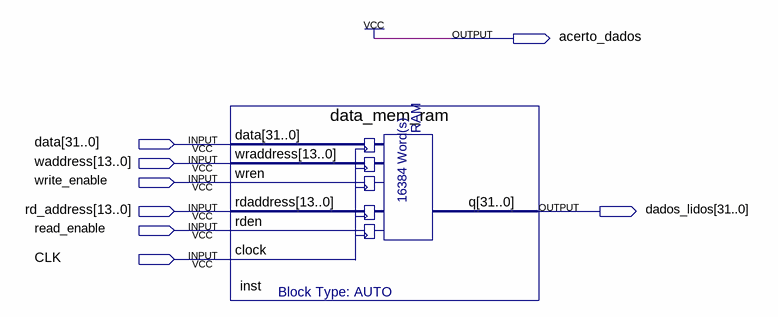
[diagram p0: schematic sheet]
// Quartus schematic datamemory.bdf as structural Verilog: 1 symbols, 8 pins
module datamemory (
  input  [31:0] data,
  input  [13:0] waddress,
  input  write_enable,
  input  [13:0] rd_address,
  input  read_enable,
  input  CLK,
  output acerto_dados,
  output [31:0] dados_lidos
);

  data_mem_ram inst (
    .data(data), .wraddress(waddress), .wren(write_enable), .rdaddress(rd_address), .rden(read_enable),
    .clock(CLK), .q(dados_lidos));

  assign acerto_dados = 1'b1;
endmodule
